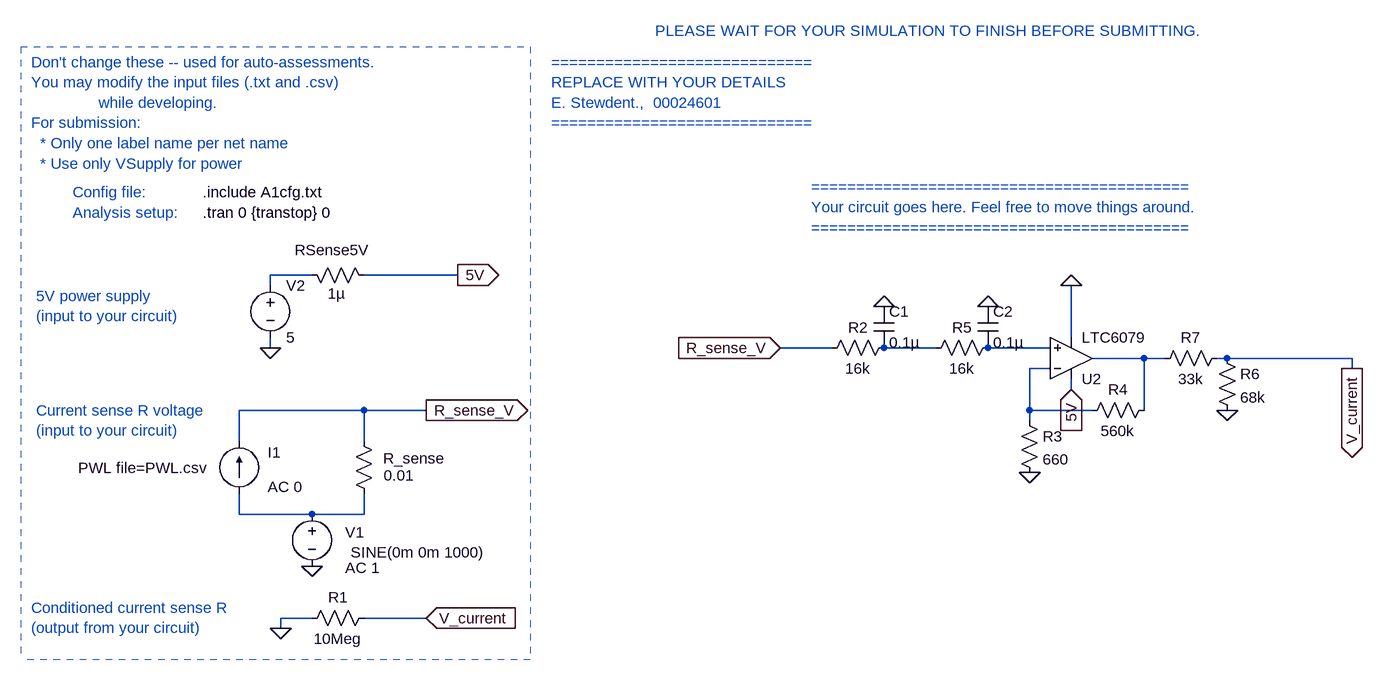
[diagram p0: schematic E344_23782684_A1.asc]
E344_23782684_A1.asc, the LTspice schematic file:
Version 4
SHEET 1 3140 2124
WIRE -1920 -1072 -1984 -1072
WIRE -1696 -1072 -1840 -1072
WIRE -1984 -1056 -1984 -1072
WIRE -752 -976 -752 -1056
WIRE -1984 -960 -1984 -976
WIRE -1120 -960 -1200 -960
WIRE -960 -960 -1040 -960
WIRE -784 -960 -880 -960
WIRE -640 -944 -720 -944
WIRE -608 -944 -640 -944
WIRE -512 -944 -528 -944
WIRE -320 -944 -512 -944
WIRE -784 -928 -816 -928
WIRE -320 -928 -320 -944
WIRE -752 -896 -752 -912
WIRE -1840 -864 -2032 -864
WIRE -1744 -864 -1840 -864
WIRE -816 -864 -816 -928
WIRE -720 -864 -816 -864
WIRE -640 -864 -640 -944
WIRE -816 -848 -816 -864
WIRE -2032 -816 -2032 -864
WIRE -1840 -816 -1840 -864
WIRE -2032 -704 -2032 -736
WIRE -1920 -704 -2032 -704
WIRE -1840 -704 -1840 -736
WIRE -1840 -704 -1920 -704
WIRE -1920 -544 -1968 -544
WIRE -1744 -544 -1840 -544
WIRE -1968 -528 -1968 -544
FLAG -1696 -1072 5V
IOPIN -1696 -1072 Out
FLAG -1984 -960 0
FLAG -752 -896 5V
IOPIN -752 -896 In
FLAG -1744 -864 R_sense_V
IOPIN -1744 -864 Out
FLAG -1920 -624 0
FLAG -320 -928 V_current
IOPIN -320 -928 Out
FLAG -1200 -960 R_sense_V
IOPIN -1200 -960 In
FLAG -1744 -544 V_current
IOPIN -1744 -544 In
FLAG -1968 -528 0
FLAG -1040 -1024 0
FLAG -816 -768 0
FLAG -880 -1024 0
FLAG -752 -1056 0
FLAG -512 -864 0
SYMBOL voltage -1984 -1072 R0
WINDOW 123 0 0 Left 0
WINDOW 39 0 0 Left 0
SYMATTR InstName V2
SYMATTR Value 5
SYMBOL res -1936 -1088 M90
WINDOW 0 -7 47 VBottom 2
WINDOW 3 29 54 VTop 2
SYMATTR InstName RSense5V
SYMATTR Value 1µ
SYMBOL res -1824 -720 R180
WINDOW 0 -109 70 Left 2
WINDOW 3 -62 44 Left 2
SYMATTR InstName R_sense
SYMATTR Value 0.01
SYMBOL current -2032 -736 R180
WINDOW 0 -64 63 Left 2
WINDOW 3 248 39 Right 2
WINDOW 123 -97 10 Left 2
WINDOW 39 0 0 Left 0
SYMATTR InstName I1
SYMATTR Value PWL file=PWL.csv
SYMATTR Value2 AC 0
SYMBOL voltage -1920 -720 R0
WINDOW 0 66 60 Bottom 2
WINDOW 3 163 59 Top 2
WINDOW 123 78 114 Bottom 2
WINDOW 39 0 0 Left 0
SYMATTR InstName V1
SYMATTR Value SINE(0m 0m 1000)
SYMATTR Value2 AC 1
SYMBOL res -1824 -560 R90
WINDOW 0 0 56 VBottom 2
WINDOW 3 32 56 VTop 2
SYMATTR InstName R1
SYMATTR Value 10Meg
SYMBOL OpAmps\\LTC6079 -752 -944 M180
SYMATTR InstName U2
SYMBOL res -1024 -976 R90
WINDOW 0 0 56 VBottom 2
WINDOW 3 32 56 VTop 2
SYMATTR InstName R2
SYMATTR Value 16k
SYMBOL cap -1056 -1024 R0
SYMATTR InstName C1
SYMATTR Value 0.1µ
SYMBOL res -832 -864 R0
SYMATTR InstName R3
SYMATTR Value 660
SYMBOL res -624 -880 R90
WINDOW 0 0 56 VBottom 2
WINDOW 3 32 56 VTop 2
SYMATTR InstName R4
SYMATTR Value 560k
SYMBOL cap -896 -1024 R0
SYMATTR InstName C2
SYMATTR Value 0.1µ
SYMBOL res -864 -976 R90
WINDOW 0 0 56 VBottom 2
WINDOW 3 32 56 VTop 2
SYMATTR InstName R5
SYMATTR Value 16k
SYMBOL res -528 -960 R0
SYMATTR InstName R6
SYMATTR Value 68k
SYMBOL res -512 -960 R90
WINDOW 0 0 56 VBottom 2
WINDOW 3 32 56 VTop 2
SYMATTR InstName R7
SYMATTR Value 33k
TEXT -2088 -1168 Left 2 !.tran 0 {transtop} 0
TEXT -2088 -1200 Left 2 !.include A1cfg.txt
TEXT -2352 -1400 Left 2 ;Don't change these -- used for auto-assessments.\nYou may modify the input files (.txt and .csv) \n               while developing.\nFor submission: \n  * Only one label name per net name\n  * Use only VSupply for power
TEXT -2288 -1200 Left 2 ;Config file:
TEXT -2288 -1168 Left 2 ;Analysis setup:
TEXT -1552 -1400 Left 2 ;=============================\nREPLACE WITH YOUR DETAILS\nE. Stewdent.,  00024601\n=============================
TEXT -1152 -1208 Left 2 ;==========================================\nYour circuit goes here. Feel free to move things around. \n==========================================
TEXT -1392 -1448 Left 2 ;PLEASE WAIT FOR YOUR SIMULATION TO FINISH BEFORE SUBMITTING.
TEXT -2344 -1040 Left 2 ;5V power supply\n(input to your circuit)
TEXT -2344 -864 Left 2 ;Current sense R voltage\n(input to your circuit)
TEXT -2352 -560 Left 2 ;Conditioned current sense R\n(output from your circuit)
LINE Normal -1584 -1424 -1584 -480 2
LINE Normal -2368 -1424 -1584 -1424 2
LINE Normal -1584 -480 -2368 -480 2
LINE Normal -1584 -496 -1584 -496 2
LINE Normal -2368 -1424 -2368 -480 2

The netlist it stands for:
* E344_23782684_A1.asc
V2 N001 0 5
RSense5V N001 5V 1µ
R_sense N006 R_sense_V 0.01
I1 N006 R_sense_V PWL file=PWL.csv AC 0
V1 N006 0 SINE(0m 0m 1000) AC 1
R1 V_current 0 10Meg
XU2 N003 N005 5V 0 N004 LTC6078  ; LTC6079, pins In+ In- V+ V- OUT
R2 N002 R_sense_V 16k
C1 0 N002 0.1µ
R3 N005 0 660
R4 N004 N005 560k
C2 0 N003 0.1µ
R5 N003 N002 16k
R6 V_current 0 68k
R7 V_current N004 33k
.tran 0 {transtop} 0
.include A1cfg.txt
* Don't change these -- used for auto-assessments.
* You may modify the input files (.txt and .csv)
*                while developing.
* For submission:
*   * Only one label name per net name
*   * Use only VSupply for power
* Config file:
* Analysis setup:
* =============================
* REPLACE WITH YOUR DETAILS
* E. Stewdent.,  00024601
* =============================
* ==========================================
* Your circuit goes here. Feel free to move things around.
* ==========================================
* PLEASE WAIT FOR YOUR SIMULATION TO FINISH BEFORE SUBMITTING.
* 5V power supply
* (input to your circuit)
* Current sense R voltage
* (input to your circuit)
* Conditioned current sense R
* (output from your circuit)
.lib LTC5.lib
.backanno
.end